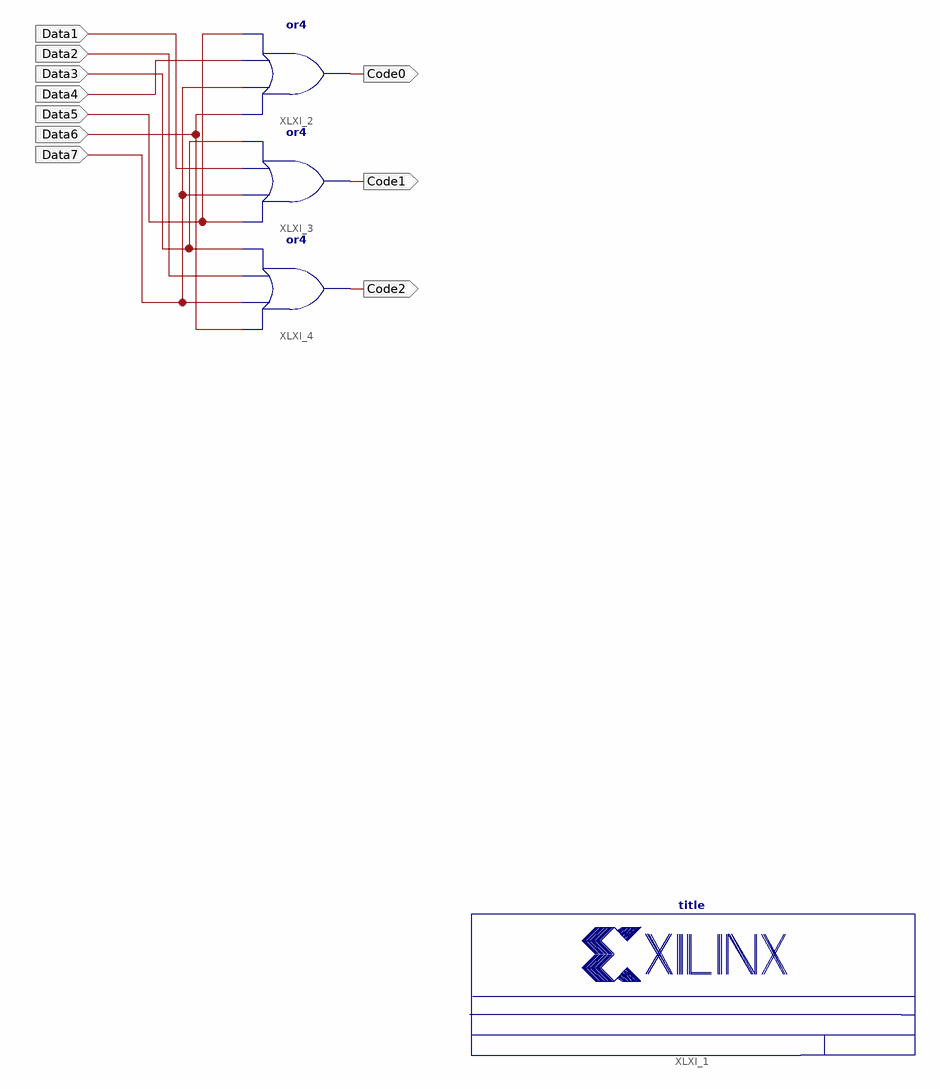
[diagram p0: schematic sheet 1]
// Xilinx ISE schematic fig_5_11.sch (spartan3e) as structural Verilog: 4 symbols, 10 ports
module fig_5_11 (
  input  Data5,
  input  Data4,
  input  Data6,
  input  Data3,
  input  Data2,
  input  Data1,
  input  Data7,
  output Code0,
  output Code1,
  output Code2
);

  title #(.NameFieldText("Figure 5.11"), .TitleFieldText("encoder83")) XLXI_1 ();
  or XLXI_2 (Code0, Data6, Data7, Data4, Data5);
  or XLXI_3 (Code1, Data5, Data7, Data1, Data3);
  or XLXI_4 (Code2, Data6, Data7, Data2, Data3);
endmodule
